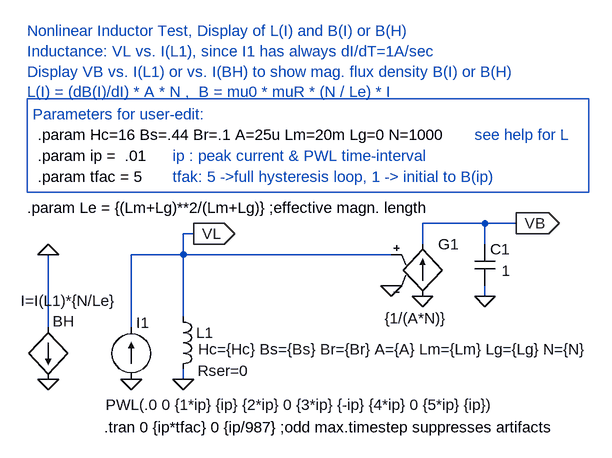
[diagram p0: schematic nonlin_inductor_test.asc]
nonlin_inductor_test.asc, the LTspice schematic file:
Version 4
SHEET 1 1300 680
WIRE 64 320 64 208
WIRE 64 208 144 208
WIRE 512 192 512 160
WIRE 512 160 608 160
WIRE 608 160 608 192
WIRE 464 208 144 208
WIRE 144 400 144 384
WIRE 144 304 144 208
WIRE -64 320 -64 208
WIRE 656 160 608 160
WIRE 144 208 144 176
WIRE 144 176 160 176
WIRE 608 272 608 256
FLAG 144 400 0
FLAG 64 400 0
FLAG 464 256 0
FLAG 512 272 0
FLAG 608 272 0
FLAG -64 400 0
FLAG -64 208 0
FLAG 656 160 VB
IOPIN 656 160 Out
FLAG 160 176 VL
IOPIN 160 176 Out
SYMBOL ind 128 288 R0
WINDOW 3 39 66 Left 0
WINDOW 39 38 99 Left 0
SYMATTR Value Hc={Hc} Bs={Bs} Br={Br} A={A} Lm={Lm} Lg={Lg} N={N}
SYMATTR InstName L1
SYMATTR SpiceLine Rser=0
SYMBOL current 64 400 R180
WINDOW 123 0 0 Left 0
WINDOW 39 0 0 Left 0
WINDOW 0 -28 87 Left 0
WINDOW 3 39 -39 Right 0
SYMATTR InstName I1
SYMATTR Value PWL(.0 0 {1*ip} {ip} {2*ip} 0 {3*ip} {-ip} {4*ip} 0 {5*ip} {ip})
SYMBOL g 512 176 R0
WINDOW 3 -58 130 Left 0
SYMATTR Value {1/(A*N)}
SYMATTR InstName G1
SYMBOL cap 592 192 R0
WINDOW 3 42 41 Left 0
SYMATTR Value 1
SYMATTR InstName C1
SYMBOL bi -64 320 R0
WINDOW 0 7 -9 Left 0
WINDOW 3 -42 -41 Left 0
SYMATTR InstName BH
SYMATTR Value I=I(L1)*{N/Le}
TEXT 22 474 Left 0 !.tran 0 {ip*tfac} 0 {ip/987} ;odd max.timestep suppresses artifacts
TEXT -96 -136 Left 0 ;Nonlinear Inductor Test, Display of L(I) and B(I) or B(H)\nInductance: VL vs. I(L1), since I1 has always dI/dT=1A/sec\nDisplay VB vs. I(L1) or vs. I(BH) to show mag. flux density B(I) or B(H)\nL(I) = (dB(I)/dI) * A * N ,  B = mu0 * muR * (N / Le) * I
TEXT -80 56 Left 0 !.param ip =  .01
TEXT -80 24 Left 0 !.param Hc=16 Bs=.44 Br=.1 A=25u Lm=20m Lg=0 N=1000
TEXT -80 88 Left 0 !.param tfac = 5
TEXT -88 -8 Left 0 ;Parameters for user-edit:
TEXT 128 56 Left 0 ;ip : peak current & PWL time-interval
TEXT 128 88 Left 0 ;tfak: 5 ->full hysteresis loop, 1 -> initial to B(ip)
TEXT 592 24 Left 0 ;see help for L
TEXT -96 136 Left 0 !.param Le = {(Lm+Lg)**2/(Lm+Lg)} ;effective magn. length
RECTANGLE Normal 768 112 -96 -32

The netlist it stands for:
* nonlin_inductor_test.asc
L1 VL 0 Hc={Hc} Bs={Bs} Br={Br} A={A} Lm={Lm} Lg={Lg} N={N} Rser=0
I1 0 VL PWL(.0 0 {1*ip} {ip} {2*ip} 0 {3*ip} {-ip} {4*ip} 0 {5*ip} {ip})
G1 0 VB VL 0 {1/(A*N)}
C1 VB 0 1
BH 0 0 I=I(L1)*{N/Le}
.tran 0 {ip*tfac} 0 {ip/987} ;odd max.timestep suppresses artifacts
* Nonlinear Inductor Test, Display of L(I) and B(I) or B(H)
* Inductance: VL vs. I(L1), since I1 has always dI/dT=1A/sec
* Display VB vs. I(L1) or vs. I(BH) to show mag. flux density B(I) or B(H)
* L(I) = (dB(I)/dI) * A * N ,  B = mu0 * muR * (N / Le) * I
.param ip =  .01
.param Hc=16 Bs=.44 Br=.1 A=25u Lm=20m Lg=0 N=1000
.param tfac = 5
* Parameters for user-edit:
* ip : peak current & PWL time-interval
* tfak: 5 ->full hysteresis loop, 1 -> initial to B(ip)
* see help for L
.param Le = {(Lm+Lg)**2/(Lm+Lg)} ;effective magn. length
.backanno
.end